# Altium project OPAMP_TESTER.PrjPcb
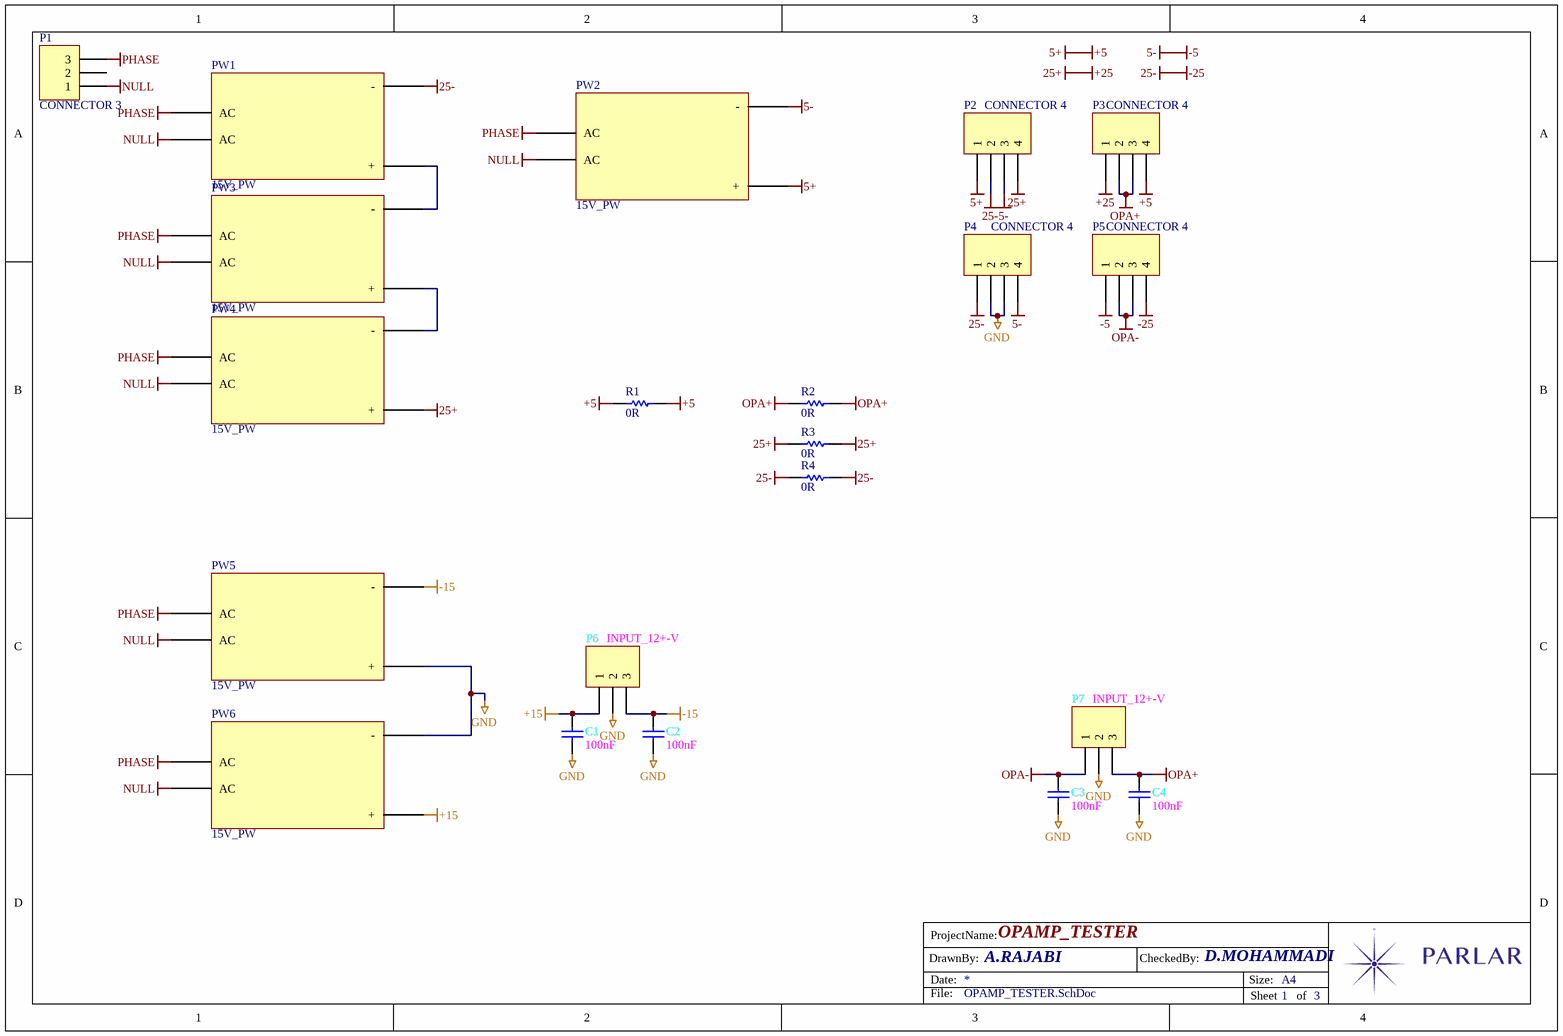
[diagram p0: OPAMP_TESTER.SchDoc]
3 sheets, 154 parts. Net scope: global (net labels, ports and power ports of the same name join across sheets).
Board files: OPAMP_TESTER.PcbDoc, OPAMP_TESTERh.PcbDoc
Sheets:
  OPAMP_TESTER.SchDoc
  OPAMP_TESTER_1.SchDoc
  OPAMP_TESTER_2.SchDoc

## Sheet OPAMP_TESTER.SchDoc: OPAMP_TESTER
size A4; CheckedBy: D.MOHAMMADI; DrawnBy: A.RAJABI; SheetNumber: 1; SheetTotal: 3

### Parts
C1  100nF  [SMD 0805]
C2  100nF  [SMD 0805]
C3  100nF  [SMD 0805]
C4  100nF  [SMD 0805]
P1  CONNECTOR 3  [CON VH 3]
P2  CONNECTOR 4  [CON HDR 2.54M 4]
P3  CONNECTOR 4  [CON HDR 2.54M 4]
P4  CONNECTOR 4  [CON HDR 2.54M 4]
P5  CONNECTOR 4  [CON HDR 2.54M 4]
P6  INPUT_12+-V  [CON XH 3]
P7  INPUT_12+-V  [CON XH 3]
PW1  15V_PW  [POW_15V]
PW2  15V_PW  [POW_5V]
PW3  15V_PW  [POW_5V]
PW4  15V_PW  [POW_5V]
PW5  15V_PW  [POW_15V]
PW6  15V_PW  [POW_15V]
R1  0R  [SMD 1206]
R2  0R  [SMD 1206]
R3  0R  [SMD 1206]
R4  0R  [SMD 1206]

### Nets
+5: P2.1 P3.4 PW2.3(+) R1.1 R1.2  [also labelled 5+]
+15: C1.2 P6.1 PW6.3(+)
+25: P2.4 P3.1 PW4.3(+) R3.1 R3.2  [also labelled 25+]
-5: P2.3 P4.4 P5.1 PW2.4(-)  [also labelled 5-]
-15: C2.2 P6.3 PW5.4(-)
-25: P2.2 P4.1 P5.4 PW1.4(-) R4.1 R4.2  [also labelled 25-]
GND: C1.1 C2.1 C3.1 C4.1 P4.2 P4.3 P6.2 P7.2 PW5.3(+) PW6.4(-)
NULL: P1.1 PW1.2(AC) PW2.2(AC) PW3.2(AC) PW4.2(AC) PW5.2(AC) PW6.2(AC)
OPA+: C4.2 P3.2 P3.3 P7.3 R2.1 R2.2
OPA-: C3.2 P5.2 P5.3 P7.1
PHASE: P1.3 PW1.1(AC) PW2.1(AC) PW3.1(AC) PW4.1(AC) PW5.1(AC) PW6.1(AC)
NetPW1_3: PW1.3(+) PW3.4(-)
NetPW3_3: PW3.3(+) PW4.4(-)

Not connected (* = marked no-connect by the designer): P1 2

### Notes on the sheet
- DrawnBy:
- ProjectName:
- Date:
- CheckedBy:
- Size:
- A4
- File:
- Sheet
- of

### Library data of the parts
C1-C4 = CAP: Capacitor; Published: 8-Jun-2000; LatestRevisionDate: 17-Jul-2002; LatestRevisionNote: Re-released for DXP Platform.; PackageReference: RAD-0.3; Publisher: Altium Limited; PackageDescription: Radial Cap, Thru-Hole; 2 Leads; 0.3 in Pin Spacing
P1 P6 P7 = CONNECTOR 3: Header, 3-Pin; LatestRevisionDate: 17-Jul-2002; LatestRevisionNote: Re-released for DXP Platform.; Publisher: Altium Limited
P2-P5 = CONNECTOR 4: Header, 4-Pin; LatestRevisionDate: 17-Jul-2002; LatestRevisionNote: Re-released for DXP Platform.; Publisher: Altium Limited
PW1-PW6 = POWER
R1-R4 = RES: Resistor

## Sheet OPAMP_TESTER_1.SchDoc: OPAMP_TESTER
size A4; CheckedBy: D.MOHAMMADI; DrawnBy: A.RAJABI; SheetNumber: 2; SheetTotal: 3
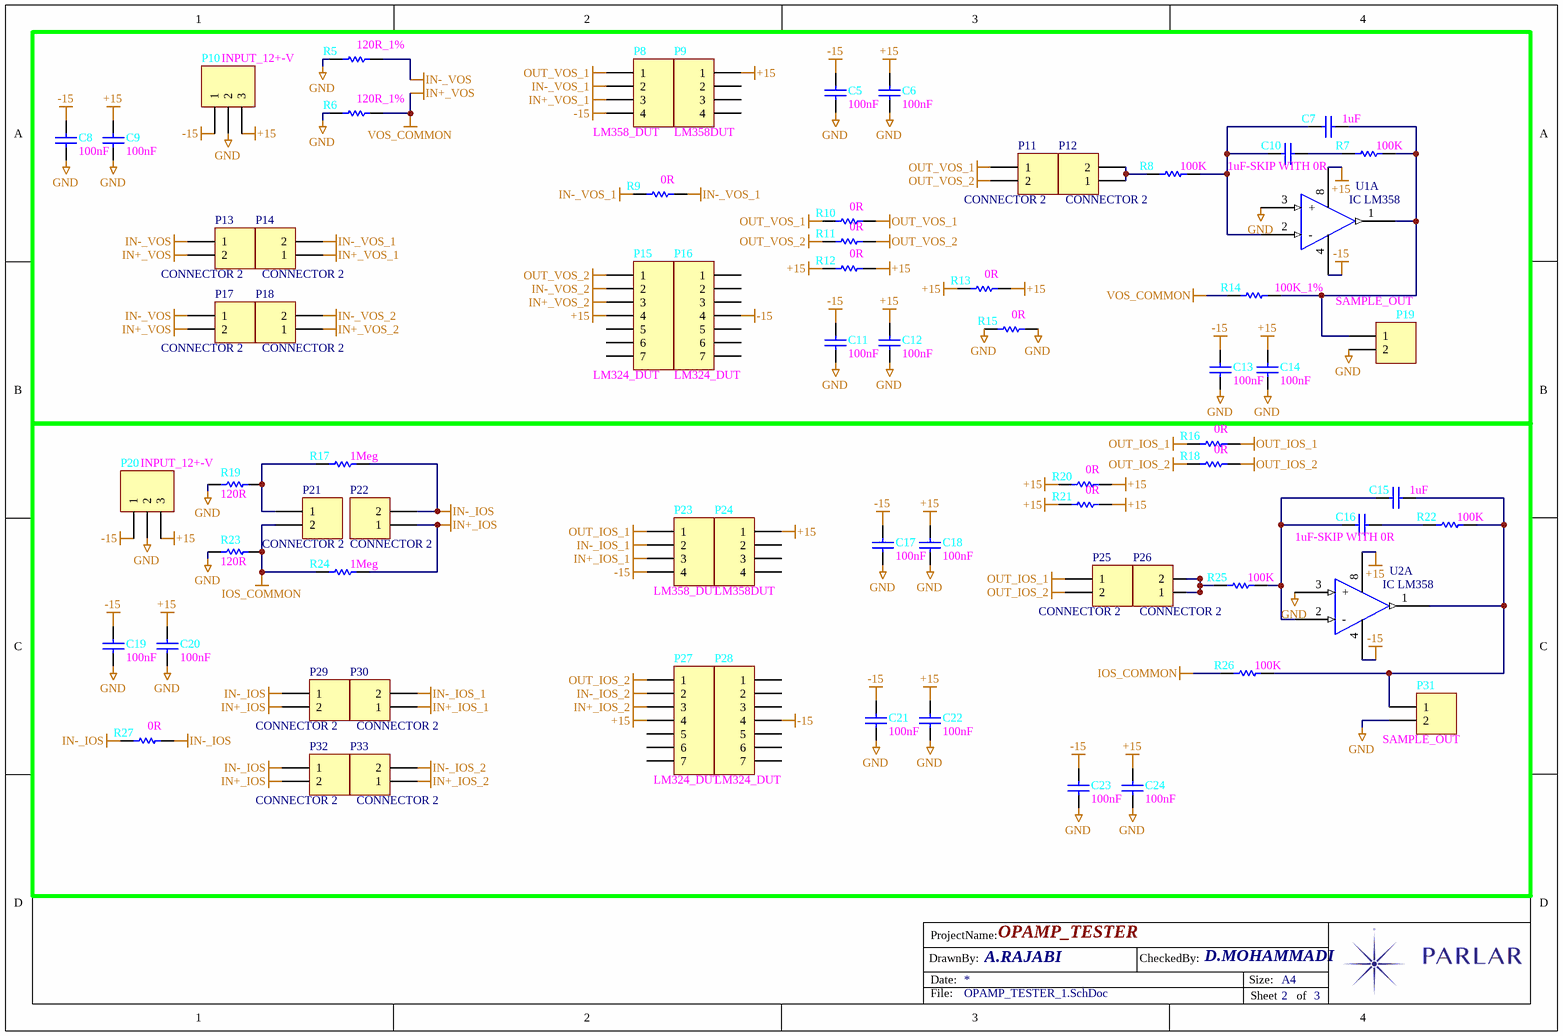
[diagram p1: OPAMP_TESTER_1.SchDoc]

### Parts
C5  100nF  [SMD 0805]
C6  100nF  [SMD 1206]
C7  1uF  [SMD 0805]
C8  100nF  [SMD 0805]
C9  100nF  [SMD 0805]
C10  1uF-SKIP WITH 0R  [SMD 0805]
C11  100nF  [SMD 0805]
C12  100nF  [SMD 1206]
C13  100nF  [SMD 0805]
C14  100nF  [SMD 0805]
C15  1uF  [SMD 1206]
C16  1uF-SKIP WITH 0R  [SMD 1206]
C17  100nF  [SMD 0805]
C18  100nF  [SMD 1206]
C19  100nF  [SMD 0805]
C20  100nF  [SMD 0805]
C21  100nF  [SMD 1206]
C22  100nF  [SMD 0805]
C23  100nF  [SMD 0805]
C24  100nF  [SMD 0805]
P8  LM358_DUT  [CON HDR 2.54FM 4]
P9  LM358DUT  [CON HDR 2.54FM 4]
P10  INPUT_12+-V  [CON XH 3]
P11  CONNECTOR 2  [CON HDR 2.54M 2]
P12  CONNECTOR 2  [CON HDR 2.54M 2]
P13  CONNECTOR 2  [CON HDR 2.54M 2]
P14  CONNECTOR 2  [CON HDR 2.54M 2]
P15  LM324_DUT  [CON HDR 2.54FM 7]
P16  LM324_DUT  [CON HDR 2.54FM 7]
P17  CONNECTOR 2  [CON HDR 2.54M 2]
P18  CONNECTOR 2  [CON HDR 2.54M 2]
P19  SAMPLE_OUT  [CON XH 2]
P20  INPUT_12+-V  [CON XH 3]
P21  CONNECTOR 2  [CON HDR 2.54M 2]
P22  CONNECTOR 2  [CON HDR 2.54M 2]
P23  LM358_DUT  [CON HDR 2.54FM 4]
P24  LM358DUT  [CON HDR 2.54FM 4]
P25  CONNECTOR 2  [CON HDR 2.54M 2]
P26  CONNECTOR 2  [CON HDR 2.54M 2]
P27  LM324_DUT  [CON HDR 2.54FM 7]
P28  LM324_DUT  [CON HDR 2.54FM 7]
P29  CONNECTOR 2  [CON HDR 2.54M 2]
P30  CONNECTOR 2  [CON HDR 2.54M 2]
P31  SAMPLE_OUT  [CON XH 2]
P32  CONNECTOR 2  [CON HDR 2.54M 2]
P33  CONNECTOR 2  [CON HDR 2.54M 2]
R5  120R_1%  [SMD 1206]
R6  120R_1%  [SMD 0805]
R7  100K  [SMD 0805]
R8  100K  [SMD 1206]
R9  0R  [SMD 1206]
R10  0R  [SMD 1206]
R11  0R  [SMD 1206]
R12  0R  [SMD 1206]
R13  0R  [SMD 1206]
R14  100K_1%  [SMD 1206]
R15  0R  [SMD 1206]
R16  0R  [SMD 1206]
R17  1Meg  [SMD 0805]
R18  0R  [SMD 1206]
R19  120R  [SMD 0805]
R20  0R  [SMD 1206]
R21  0R  [SMD 1206]
R22  100K  [SMD 0805]
R23  120R  [SMD 0805]
R24  1Meg  [SMD 0805]
R25  100K  [SMD 1206]
R26  100K  [SMD 0805]
R27  0R  [SMD 1206]
U1  IC LM358  [SMD IC SOP8]  (part A of 2)
U2  IC LM358  [SMD IC SOP8]  (part A of 2)

### Nets
+15: C6.2 C9.2 C12.2 C14.2 C18.2 C20.2 C22.2 C24.2 P9.1 P10.3 P15.4 P20.3 P24.1 P27.4 R12.1 R12.2 R13.1 R13.2 R20.1 R20.2 R21.1 R21.2 U1.8(VCC) U2.8(VCC)
-15: C5.2 C8.2 C11.2 C13.2 C17.2 C19.2 C21.2 C23.2 P8.4 P10.1 P16.4 P20.1 P23.4 P28.4 U1.4(GND) U2.4(GND)
GND: C5.1 C6.1 C8.1 C9.1 C11.1 C12.1 C13.1 C14.1 C17.1 C18.1 C19.1 C20.1 C21.1 C22.1 C23.1 C24.1 P10.2 P19.2 P20.2 P31.2 R5.1 R6.1 R15.1 R15.2 R19.1 R23.1 U1.3(+) U2.3(+)
IN+_IOS: P22.1 P29.2 P32.2 R24.2
IN+_IOS_1: P23.3 P30.1
IN+_IOS_2: P27.3 P33.1
IN+_VOS: P13.2 P17.2 R6.2 R14.1  [also labelled VOS_COMMON]
IN+_VOS_1: P8.3 P14.1
IN+_VOS_2: P15.3 P18.1
IN-_IOS: P22.2 P29.1 P32.1 R17.2 R27.1 R27.2
IN-_IOS_1: P23.2 P30.2
IN-_IOS_2: P27.2 P33.2
IN-_VOS: P13.1 P17.1 R5.2
IN-_VOS_1: P8.2 P14.2 R9.1 R9.2
IN-_VOS_2: P15.2 P18.2
IOS_COMMON: P21.2 R23.2 R24.1 R26.1
OUT_IOS_1: P23.1 P25.1 R16.1 R16.2
OUT_IOS_2: P25.2 P27.1 R18.1 R18.2
OUT_VOS_1: P8.1 P11.1 R10.1 R10.2
OUT_VOS_2: P11.2 P15.1 R11.1 R11.2
NetC7_1: C7.1 P19.1 R7.2 R14.2 U1.1(OUT1)
NetC7_2: C7.2 C10.2 R8.2 U1.2(-)
NetC10_1: C10.1 R7.1
NetC15_1: C15.1 P31.1 R22.2 R26.2 U2.1(OUT1)
NetC15_2: C15.2 C16.2 R25.2 U2.2(-)
NetC16_1: C16.1 R22.1
NetP12_1: P12.1 P12.2 R8.1
NetP21_1: P21.1 R17.1 R19.2
NetP26_1: P26.1 P26.2 R25.1

Not connected (* = marked no-connect by the designer): P9 2 3 4; P15 5 6 7; P16 1 2 3 5 6 7; P24 2 3 4; P27 5 6 7; P28 1 2 3 5 6 7

### Notes on the sheet
- DrawnBy:
- ProjectName:
- Date:
- CheckedBy:
- Size:
- A4
- File:
- Sheet
- of

### Library data of the parts
C5-C24 = CAP: Capacitor; Published: 8-Jun-2000; LatestRevisionDate: 17-Jul-2002; LatestRevisionNote: Re-released for DXP Platform.; PackageReference: RAD-0.3; Publisher: Altium Limited; PackageDescription: Radial Cap, Thru-Hole; 2 Leads; 0.3 in Pin Spacing
P8 P9 P23 P24 = CONNECTOR 4: Header, 4-Pin; LatestRevisionDate: 17-Jul-2002; LatestRevisionNote: Re-released for DXP Platform.; Publisher: Altium Limited
P10 P20 = CONNECTOR 3: Header, 3-Pin; LatestRevisionDate: 17-Jul-2002; LatestRevisionNote: Re-released for DXP Platform.; Publisher: Altium Limited
P11-P14 P17-P19 P21 P22 P25 P26 P29-P33 = CONNECTOR 2: Header, 2-Pin; LatestRevisionDate: 17-Jul-2002; LatestRevisionNote: Re-released for DXP Platform.; Publisher: Altium Limited
P15 P16 P27 P28 = CONNECTOR 7: Header, 7-Pin; LatestRevisionDate: 17-Jul-2002; LatestRevisionNote: Re-released for DXP Platform.; Publisher: Altium Limited
R5-R27 = RES: Resistor

## Sheet OPAMP_TESTER_2.SchDoc: OPAMP_TESTER
size A4; CheckedBy: D.MOHAMMADI; DrawnBy: A.RAJABI; SheetNumber: 3; SheetTotal: 3
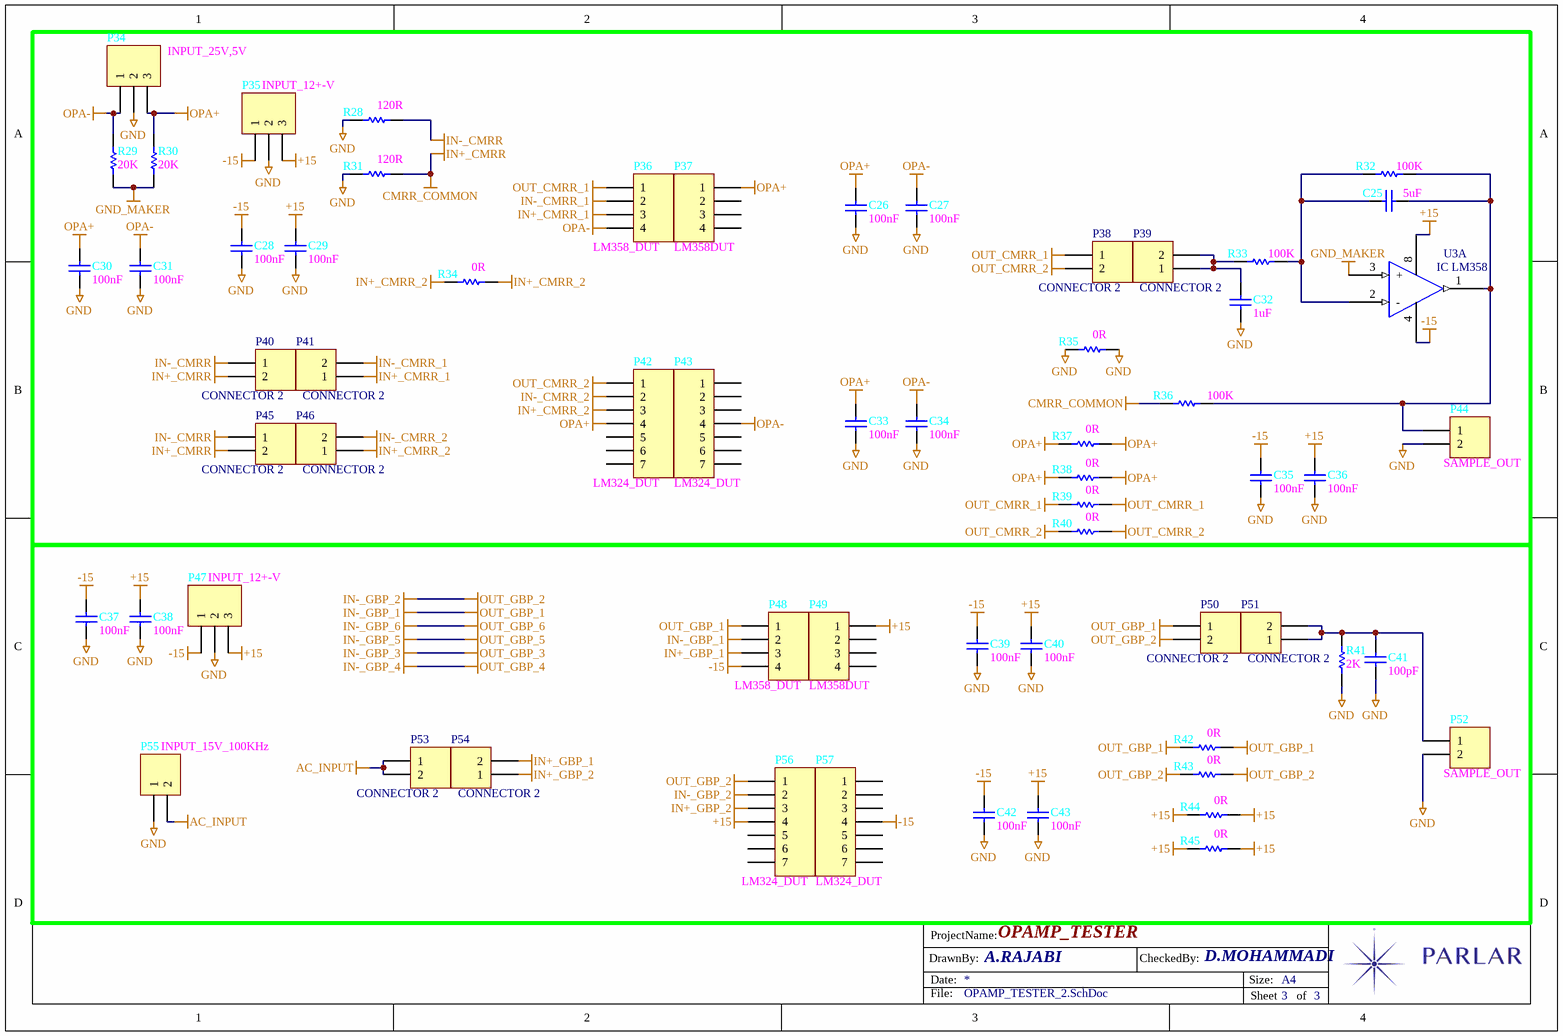
[diagram p2: OPAMP_TESTER_2.SchDoc]

### Parts
C25  5uF  [SMD 1206]
C26  100nF  [SMD 1206]
C27  100nF  [SMD 0805]
C28  100nF  [SMD 0805]
C29  100nF  [SMD 0805]
C30  100nF  [SMD 0805]
C31  100nF  [SMD 0805]
C32  1uF  [SMD 0805]
C33  100nF  [SMD 1206]
C34  100nF  [SMD 0805]
C35  100nF  [SMD 0805]
C36  100nF  [SMD 0805]
C37  100nF  [SMD 0805]
C38  100nF  [SMD 0805]
C39  100nF  [SMD 0805]
C40  100nF  [SMD 0805]
C41  100pF  [SMD 0805]
C42  100nF  [SMD 0805]
C43  100nF  [SMD 1206]
P34  INPUT_25V,5V  [CON XH 3]
P35  INPUT_12+-V  [CON XH 3]
P36  LM358_DUT  [CON HDR 2.54FM 4]
P37  LM358DUT  [CON HDR 2.54FM 4]
P38  CONNECTOR 2  [CON HDR 2.54M 2]
P39  CONNECTOR 2  [CON HDR 2.54M 2]
P40  CONNECTOR 2  [CON HDR 2.54M 2]
P41  CONNECTOR 2  [CON HDR 2.54M 2]
P42  LM324_DUT  [CON HDR 2.54FM 7]
P43  LM324_DUT  [CON HDR 2.54FM 7]
P44  SAMPLE_OUT  [CON XH 2]
P45  CONNECTOR 2  [CON HDR 2.54M 2]
P46  CONNECTOR 2  [CON HDR 2.54M 2]
P47  INPUT_12+-V  [CON XH 3]
P48  LM358_DUT  [CON HDR 2.54FM 4]
P49  LM358DUT  [CON HDR 2.54FM 4]
P50  CONNECTOR 2  [CON HDR 2.54M 2]
P51  CONNECTOR 2  [CON HDR 2.54M 2]
P52  SAMPLE_OUT  [CON XH 2]
P53  CONNECTOR 2  [CON HDR 2.54M 2]
P54  CONNECTOR 2  [CON HDR 2.54M 2]
P55  INPUT_15V_100KHz  [CON XH 2]
P56  LM324_DUT  [CON HDR 2.54FM 7]
P57  LM324_DUT  [CON HDR 2.54FM 7]
R28  120R  [SMD 0805]
R29  20K  [SMD 1206]
R30  20K  [SMD 0805]
R31  120R  [SMD 1206]
R32  100K  [SMD 0805]
R33  100K  [SMD 1206]
R34  0R  [SMD 1206]
R35  0R  [SMD 1206]
R36  100K  [SMD 1206]
R37  0R  [SMD 1206]
R38  0R  [SMD 1206]
R39  0R  [SMD 1206]
R40  0R  [SMD 1206]
R41  2K  [SMD 0805]
R42  0R  [SMD 1206]
R43  0R  [SMD 1206]
R44  0R  [SMD 1206]
R45  0R  [SMD 1206]
U3  IC LM358  [SMD IC SOP8]  (part A of 2)

### Nets
+15: C29.2 C36.2 C38.2 C40.2 C43.2 P35.3 P47.3 P49.1 P56.4 R44.1 R44.2 R45.1 R45.2 U3.8(VCC)
-15: C28.2 C35.2 C37.2 C39.2 C42.2 P35.1 P47.1 P48.4 P57.4 U3.4(GND)
AC_INPUT: P53.1 P53.2 P55.2
CMRR_COMMON: P40.2 P45.2 R31.2 R36.1  [also labelled IN+_CMRR]
GND: C26.1 C27.1 C28.1 C29.1 C30.1 C31.1 C32.1 C33.1 C34.1 C35.1 C36.1 C37.1 C38.1 C39.1 C40.1 C41.1 C42.1 C43.1 P34.2 P35.2 P44.2 P47.2 P52.2 P55.1 R28.1 R31.1 R35.1 R35.2 R41.2
GND_MAKER: R29.1 R30.1 U3.3(+)
IN+_CMRR_1: P36.3 P41.1
IN+_CMRR_2: P42.3 P46.1 R34.1 R34.2
IN+_GBP_1: P48.3 P54.2
IN+_GBP_2: P54.1 P56.3
IN-_CMRR: P40.1 P45.1 R28.2
IN-_CMRR_1: P36.2 P41.2
IN-_CMRR_2: P42.2 P46.2
IN-_GBP_1: P48.1 P48.2 P50.1 R42.1 R42.2  [also labelled OUT_GBP_1]
IN-_GBP_2: P50.2 P56.1 P56.2 R43.1 R43.2  [also labelled OUT_GBP_2]
OPA+: C26.2 C30.2 C33.2 P34.3 P37.1 P42.4 R30.2 R37.1 R37.2 R38.1 R38.2
OPA-: C27.2 C31.2 C34.2 P34.1 P36.4 P43.4 R29.2
OUT_CMRR_1: P36.1 P38.1 R39.1 R39.2
OUT_CMRR_2: P38.2 P42.1 R40.1 R40.2
NetC25_1: C25.1 P44.1 R32.2 R36.2 U3.1(OUT1)
NetC25_2: C25.2 R32.1 R33.2 U3.2(-)
NetC32_2: C32.2 P39.1 P39.2 R33.1
NetC41_2: C41.2 P51.1 P51.2 P52.1 R41.1

Not connected (* = marked no-connect by the designer): P37 2 3 4; P42 5 6 7; P43 1 2 3 5 6 7; P49 2 3 4; P56 5 6 7; P57 1 2 3 5 6 7

### Notes on the sheet
- DrawnBy:
- ProjectName:
- Date:
- CheckedBy:
- Size:
- A4
- File:
- Sheet
- of

### Library data of the parts
C25-C43 = CAP: Capacitor; Published: 8-Jun-2000; LatestRevisionDate: 17-Jul-2002; LatestRevisionNote: Re-released for DXP Platform.; PackageReference: RAD-0.3; Publisher: Altium Limited; PackageDescription: Radial Cap, Thru-Hole; 2 Leads; 0.3 in Pin Spacing
P34 P35 P47 = CONNECTOR 3: Header, 3-Pin; LatestRevisionDate: 17-Jul-2002; LatestRevisionNote: Re-released for DXP Platform.; Publisher: Altium Limited
P36 P37 P48 P49 = CONNECTOR 4: Header, 4-Pin; LatestRevisionDate: 17-Jul-2002; LatestRevisionNote: Re-released for DXP Platform.; Publisher: Altium Limited
P38-P41 P44-P46 P50-P55 = CONNECTOR 2: Header, 2-Pin; LatestRevisionDate: 17-Jul-2002; LatestRevisionNote: Re-released for DXP Platform.; Publisher: Altium Limited
P42 P43 P56 P57 = CONNECTOR 7: Header, 7-Pin; LatestRevisionDate: 17-Jul-2002; LatestRevisionNote: Re-released for DXP Platform.; Publisher: Altium Limited
R28-R45 = RES: Resistor

## Nets that join several sheets
+15: OPAMP_TESTER (C1.2 P6.1 PW6.3), OPAMP_TESTER_1 (24 pins), OPAMP_TESTER_2 (14 pins)
-15: OPAMP_TESTER (C2.2 P6.3 PW5.4), OPAMP_TESTER_1 (16 pins), OPAMP_TESTER_2 (10 pins)
GND: OPAMP_TESTER (10 pins), OPAMP_TESTER_1 (28 pins), OPAMP_TESTER_2 (29 pins)
OPA+: OPAMP_TESTER (6 pins), OPAMP_TESTER_2 (11 pins)
OPA-: OPAMP_TESTER (C3.2 P5.2 P5.3 P7.1), OPAMP_TESTER_2 (7 pins)